# EAGLE design v2.2_lux (EAGLE 7.1.0)
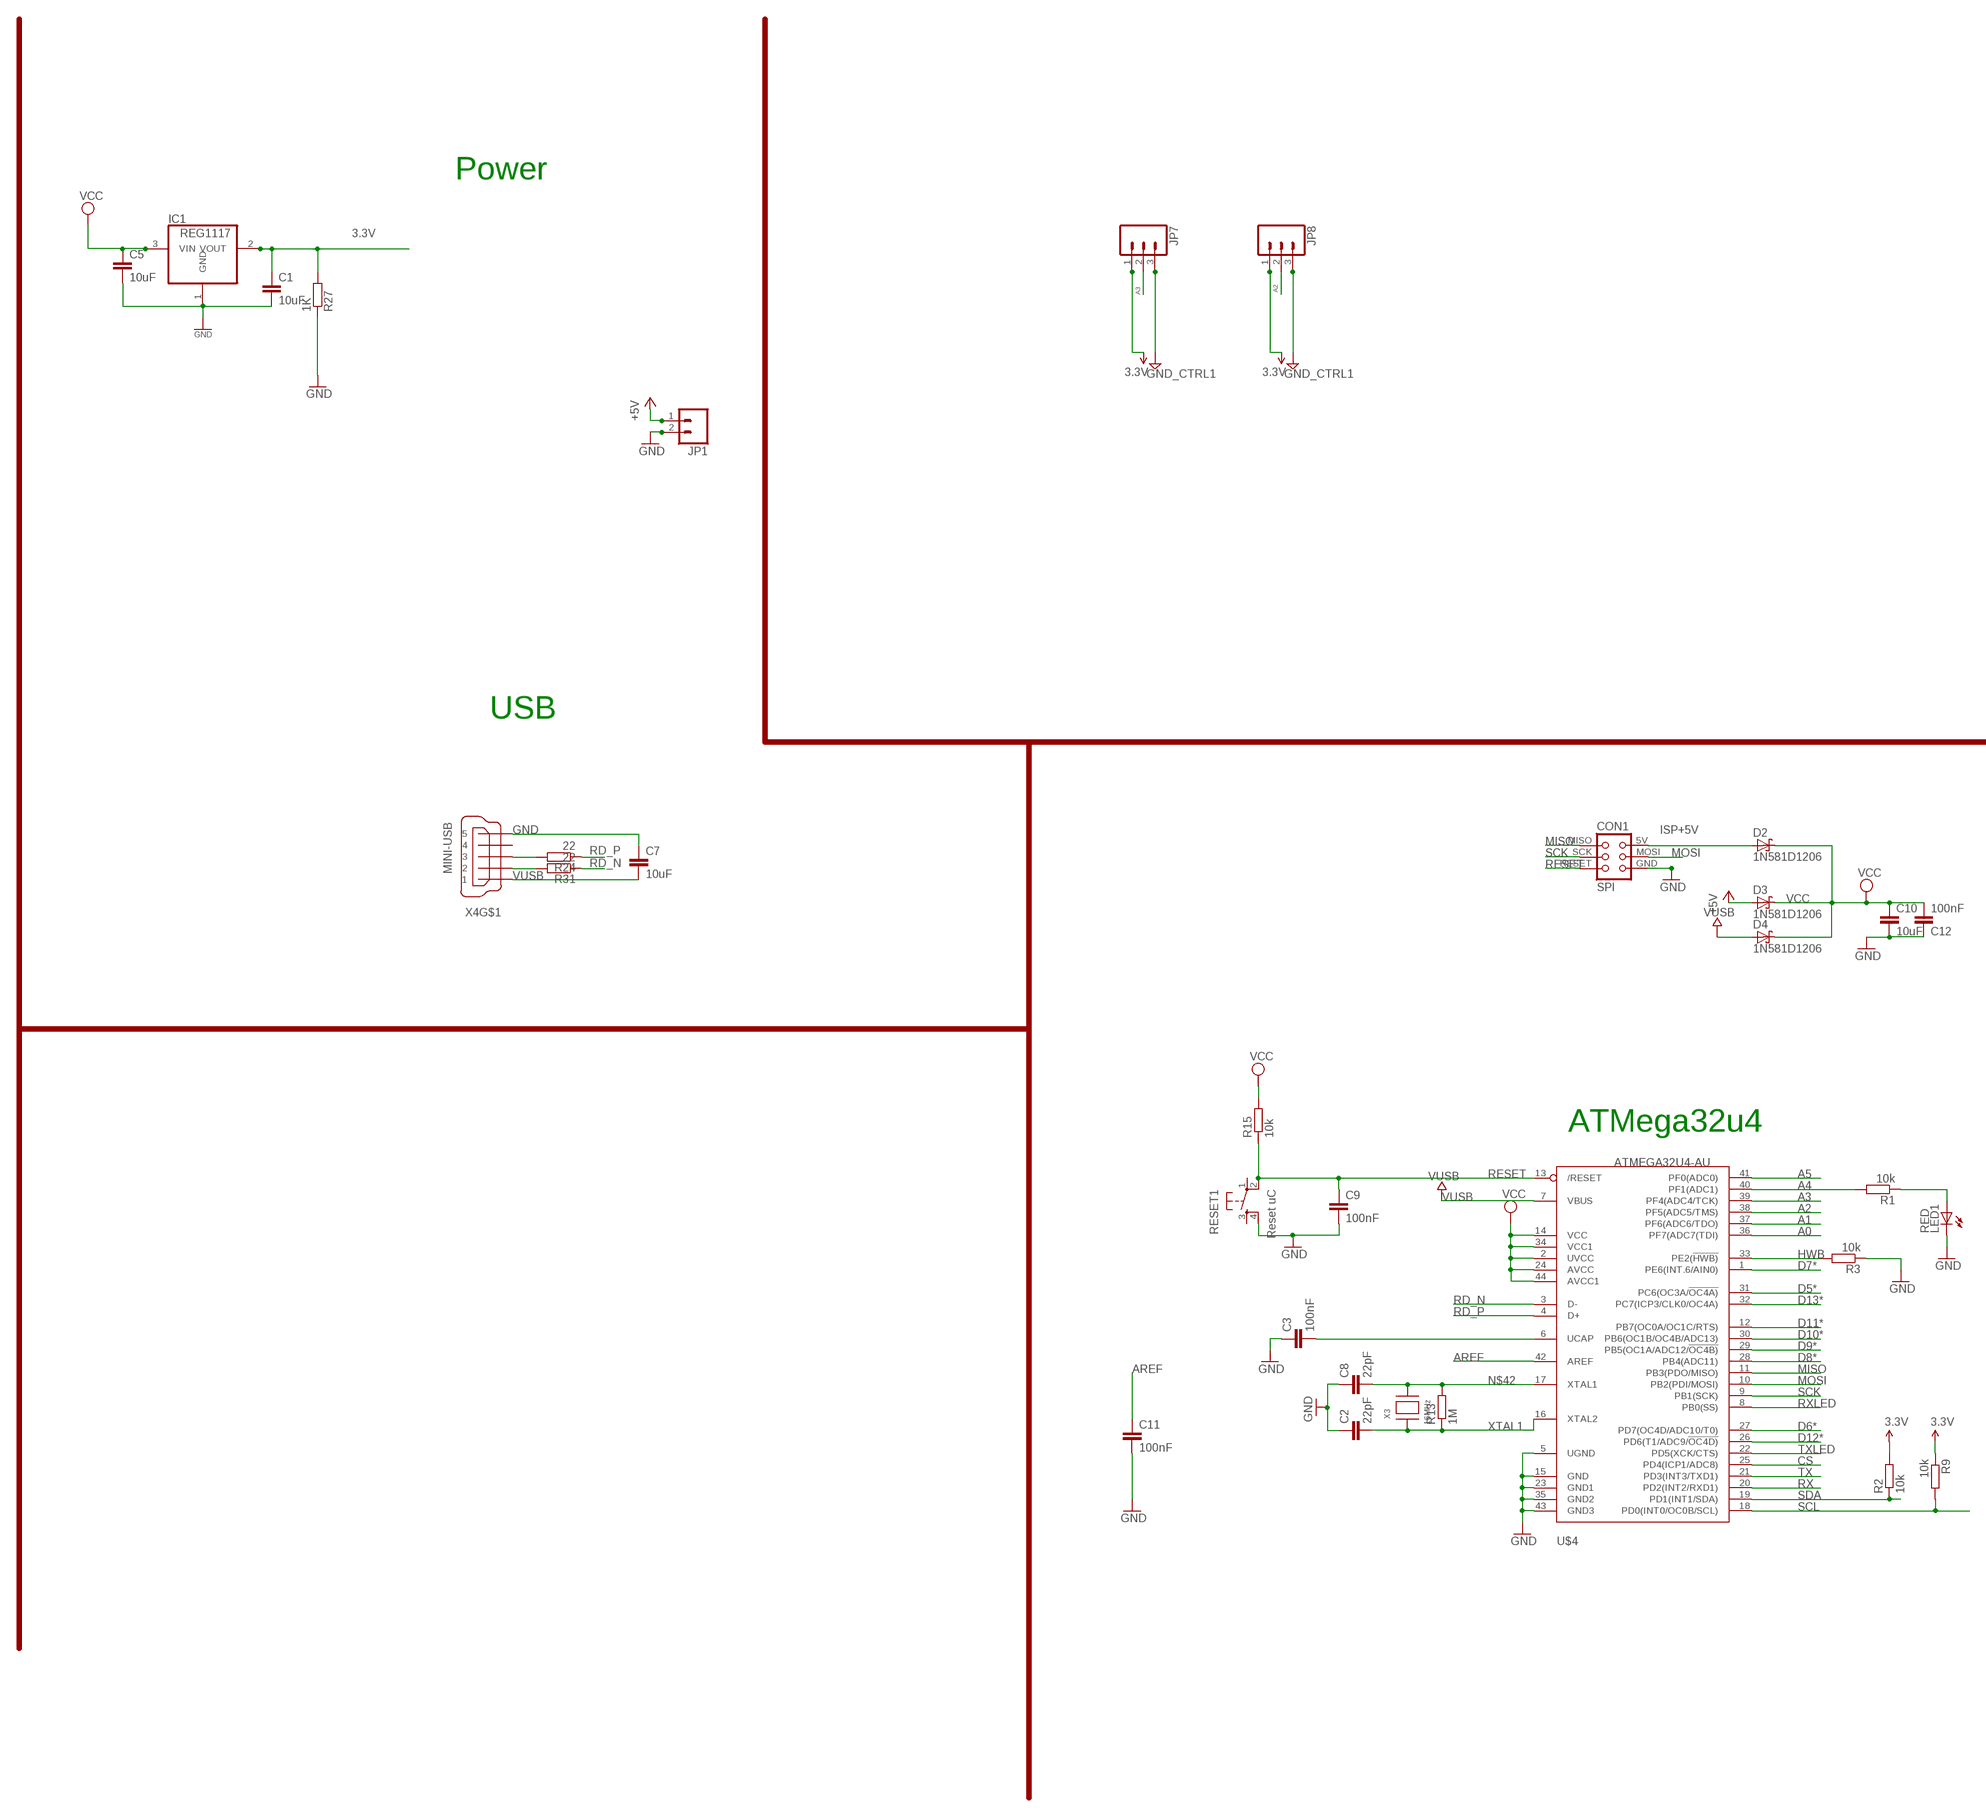
[diagram p0: schematic, sheet 1, part 1 of 2]
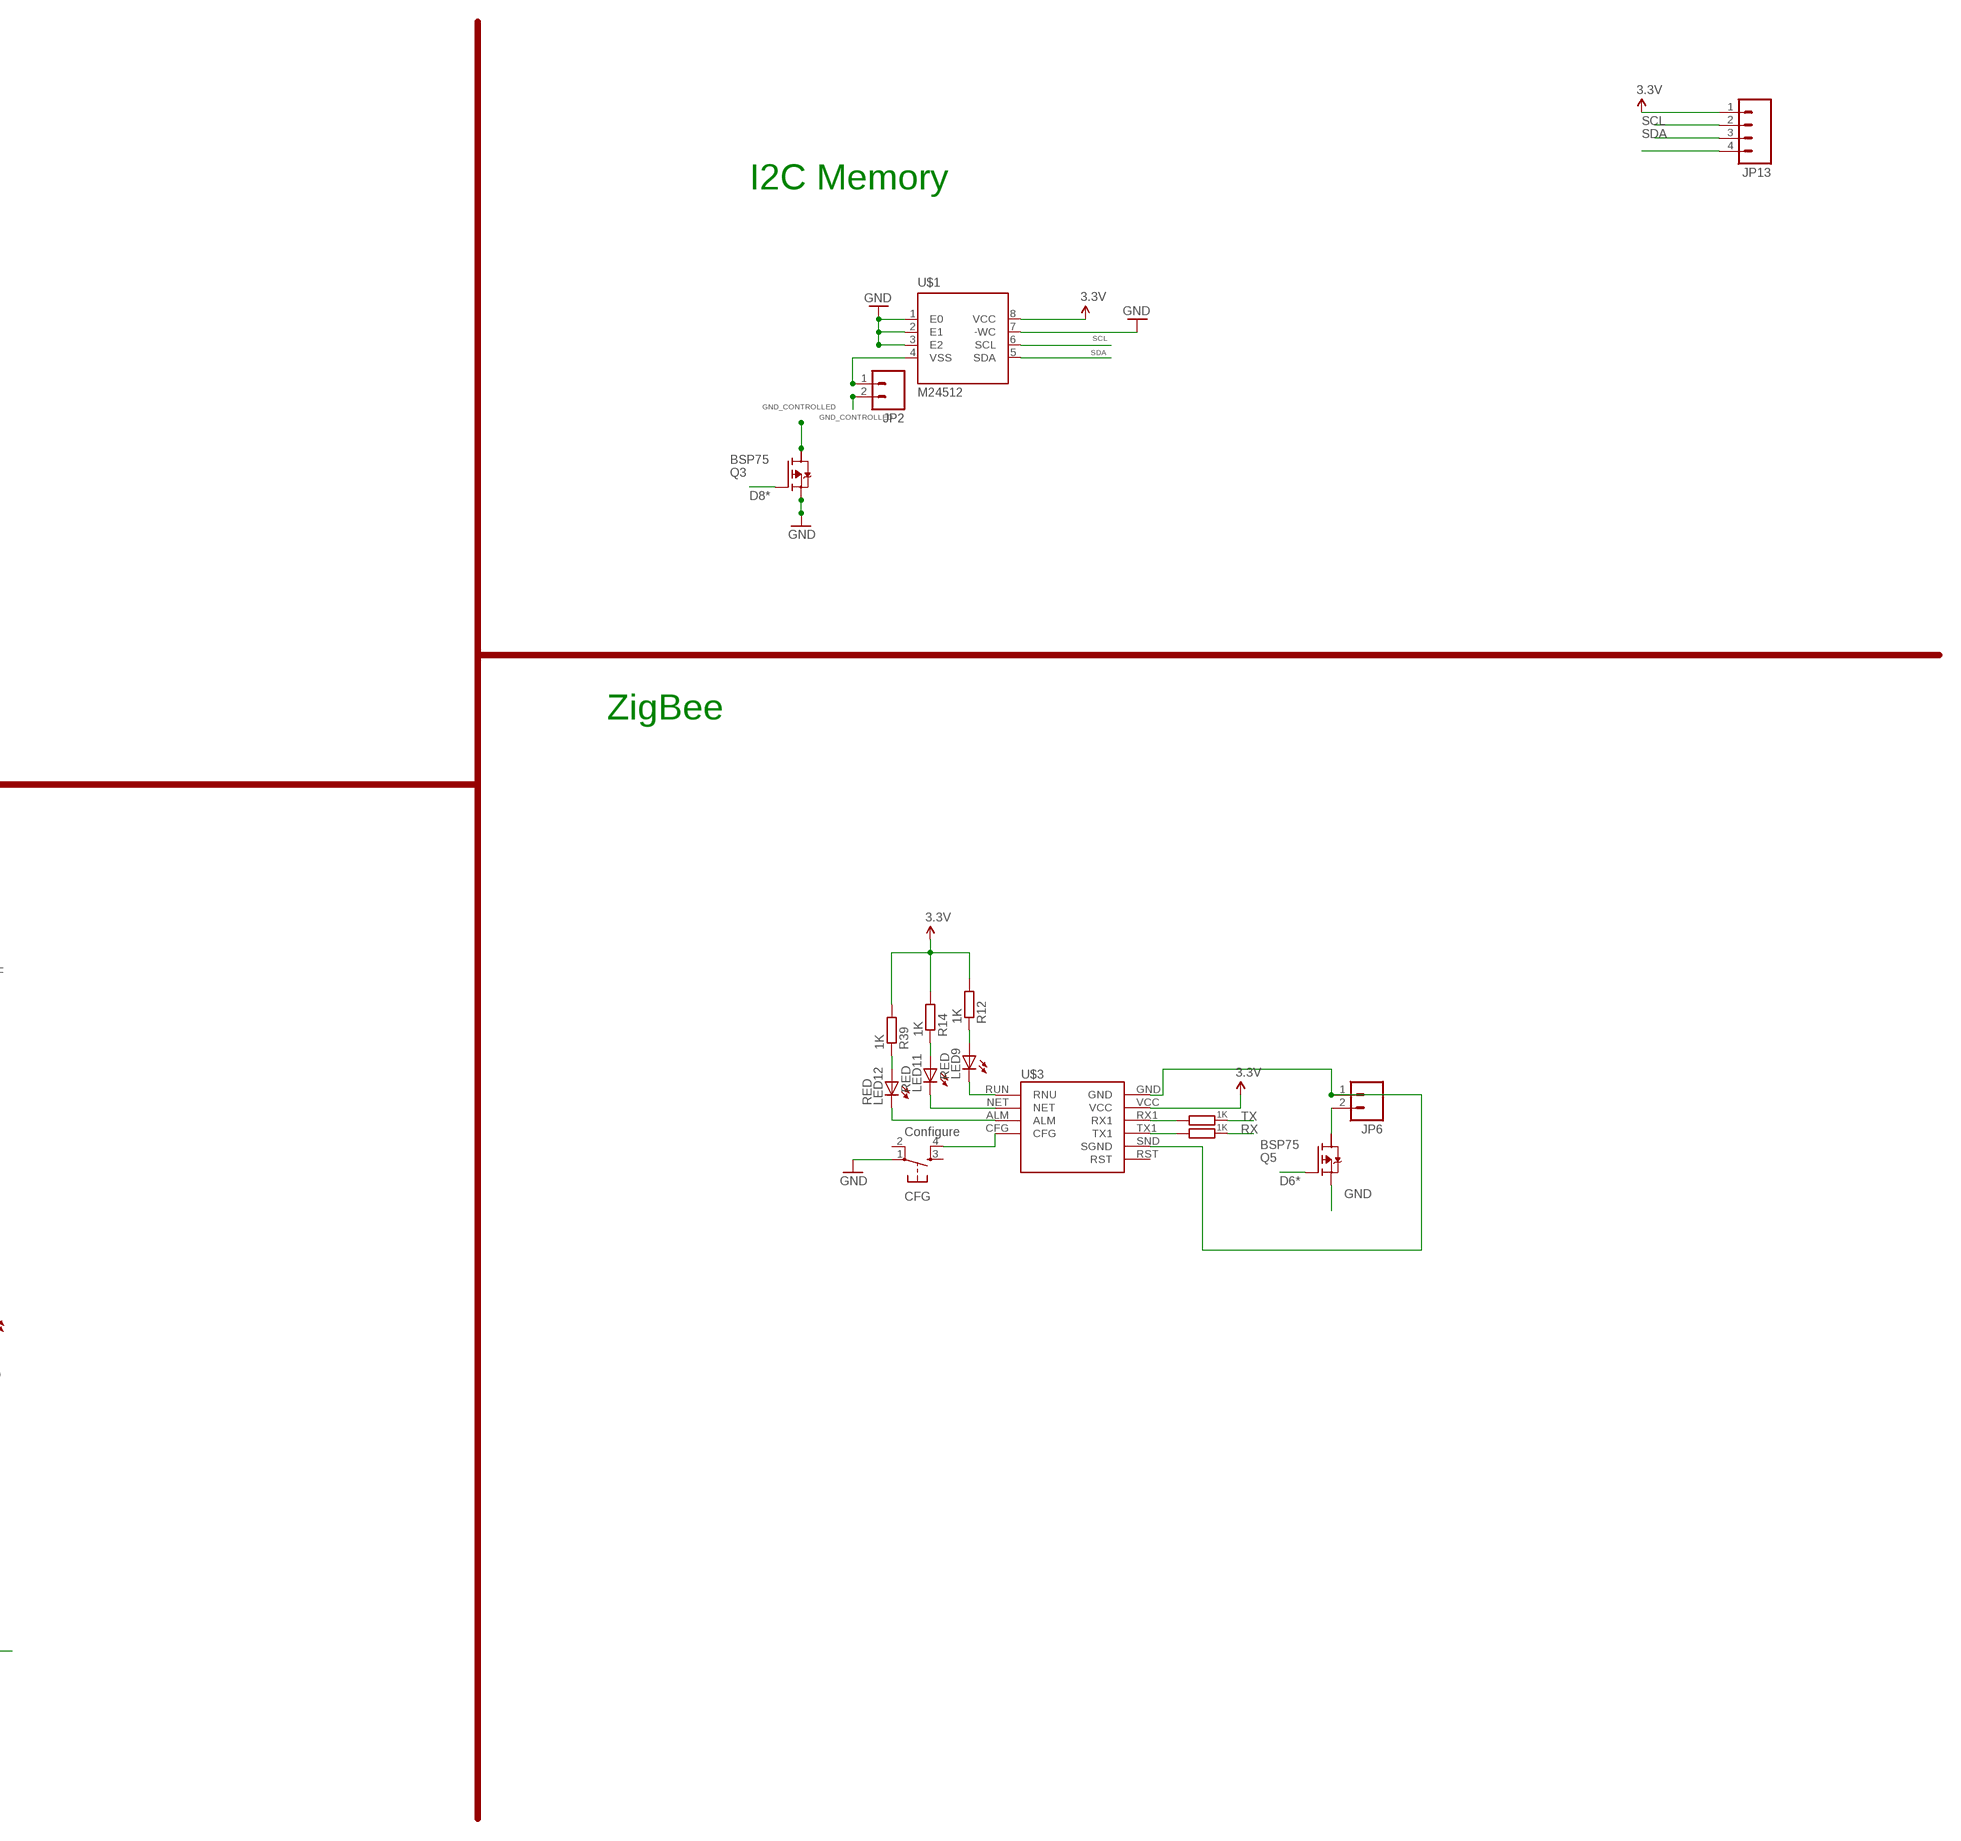
[diagram p1: schematic, sheet 1, part 2 of 2]

## Parts
C1  10uF  C-EUC1206  [C1206]
C2  22pF  C-EUC1206  [C1206]
C3  100nF  C-EUC1206  [C1206]
C5  10uF  C-EUC1206  [C1206]
C7  10uF  C-EUC1206  [C1206]
C8  22pF  C-EUC1206  [C1206]
C9  100nF  C-EUC1206  [C1206]
C10  10uF  C-EUC1206  [C1206]
C11  100nF  C-EUC1206  [C1206]
C12  100nF  C-EUC1206  [C1206]
CFG  Configure  TAC_SWITCHSMD  [TACTILE_SWITCH_SMD]
CON1  SPI  TINYISPT  [TC2030-MCP-NL]
D2  1N581D1206  [LED-1206]
D3  1N581D1206  [LED-1206]
D4  1N581D1206  [LED-1206]
IC1  REG1117  [SOT223]
JP1  M02LOCK_LONGPADS  [1X02_LOCK_LONGPADS]
JP2  M02LOCK_LONGPADS  [1X02_LOCK_LONGPADS]
JP6  M02LOCK_LONGPADS  [1X02_LOCK_LONGPADS]
JP7  M03LONGPADS  [1X03_LONGPADS]
JP8  M03LONGPADS  [1X03_LONGPADS]
JP13  M04LOCK_LONGPADS  [1X04_LOCK_LONGPADS]
LED1  RED  LEDCHIP-LED0805  [CHIP-LED0805]
LED9  RED  LEDCHIP-LED0805  [CHIP-LED0805]
LED11  RED  LEDCHIP-LED0805  [CHIP-LED0805]
LED12  RED  LEDCHIP-LED0805  [CHIP-LED0805]
Q3  BSP75  BSP613P  [PG-SOT-223]
Q5  BSP75  BSP613P  [PG-SOT-223]
R1  10k  R-EU_M1206  [M1206]
R2  10k  R-EU_M1206  [M1206]
R3  10k  R-EU_M1206  [M1206]
R8  1K  R-EU_R0805  [R0805]
R9  10k  R-EU_M1206  [M1206]
R11  1K  R-EU_R0805  [R0805]
R12  1K  R-EU_R0805  [R0805]
R13  1M  R-EU_R1206  [R1206]
R14  1K  R-EU_R0805  [R0805]
R15  10k  R-EU_M0805  [M0805]
R24  22  R-EU_M1206  [M1206]
R27  1K  R-EU_R0805  [R0805]
R31  22  R-EU_M1206  [M1206]
R39  1K  R-EU_R0805  [R0805]
RESET1  Reset uC  TAC_SWITCHSMD  [TACTILE_SWITCH_SMD]
U$1  M24512  [SO8]
U$3  SZ05-ZIGBEETHROUGHHOLE  [SZ05-ZIGBEE4]
U$4  ATMEGA32U4-AU  [TQFP44]
X3  16MHz  XTALNX6035  [NX6035]
X4  MINI-USB  MINI-USB-SCHIELD-32005-201  [32005-201]

## Nets
3.3V [power]: C1.1 IC1.2(VOUT) JP7.1 JP8.1 JP13.1 R2.2 R9.1 R12.2 R14.2 R27.2 R39.2 U$1.8(VCC) U$3.VCC
$12: JP2.1 U$1.4(VSS)
+5V [power]: D3.A JP1.1
A0: U$4.36(PF7(ADC7(TDI))
A1: U$4.37(PF6(ADC6/TDO))
A2: JP8.2 U$4.38(PF5(ADC5/TMS))
A3: JP7.2 U$4.39(PF4(ADC4/TCK))
A4: R1.2 U$4.40(PF1(ADC1))
A5: U$4.41(PF0(ADC0))
AREF: C11.1 U$4.42(AREF)
CS: U$4.25(PD4(ICP1/ADC8))
D5*: U$4.31(PC6(OC3A/!OC4A))
D6*: Q5.1(G) U$4.27(PD7(OC4D/ADC10/T0))
D7*: U$4.1(PE6(INT.6/AIN0))
D8*: Q3.1(G) U$4.28(PB4(ADC11))
D9*: U$4.29(PB5(OC1A/ADC12/!OC4B))
D10*: U$4.30(PB6(OC1B/OC4B/ADC13))
D11*: U$4.12(PB7(OC0A/OC1C/RTS))
D12*: U$4.26(PD6(T1/ADC9/!OC4D))
D13*: U$4.32(PC7(ICP3/CLK0/OC4A))
D+USB: R24.2 X4.3
D-USB: R31.2 X4.2
GND [power]: C1.2 C2.1 C3.1 C5.2 C7.1 C8.1 C9.2 C10.2 C11.2 C12.1 CFG.1 CON1.GND IC1.1(GND) JP1.2 JP7.3 JP8.3 LED1.C Q3.3(S) Q5.3(S) R3.1 R27.1 RESET1.4 U$1.1(E0) U$1.2(E1) U$1.3(E2) U$1.7(-WC) U$4.5(UGND) U$4.15(GND) U$4.23(GND1) U$4.35(GND2) U$4.43(GND3) X4.5 ; supply symbol labelled GND_CTRL1
GND1 [VIN]: LED9.C U$3.RUN(RNU)
GND2 [VIN]: LED11.C U$3.NET
GND3 [VIN]: LED12.C U$3.ALM
GND_CONTROLLED [power]: JP2.2 JP13.4 Q3.2(D)
HWB: R3.2 U$4.33(PE2(!HWB))
ISP+5V: CON1.5V(VCC) D2.A
MISO: CON1.MISO U$4.11(PB3(PDO/MISO))
MOSI: CON1.MOSI U$4.10(PB2(PDI/MOSI))
N$1: LED1.A R1.1
N$2: JP6.2 Q5.2(D)
N$4 [power]: JP6.1 U$3.GND U$3.SND(SGND)
N$11: R11.2 U$3.RX1
N$16: C3.2 U$4.6(UCAP)
N$24: R8.2 U$3.TX1
N$25: LED9.A R12.1
N$26: LED11.A R14.1
N$27: LED12.A R39.1
N$35: CFG.4 U$3.CFG
N$42: C8.2 R13.2 U$4.17(XTAL1) X3.P$2
RD_N: R31.1 U$4.3(D-)
RD_P: R24.1 U$4.4(D+)
RESET: C9.1 CON1.RESET R15.1 RESET1.2 U$4.13(/RESET)
RX: R8.1 U$4.20(PD2(INT2/RXD1))
RXLED: U$4.8(PB0(SS))
SCK: CON1.SCK U$4.9(PB1(SCK))
SCL: JP13.2 R9.2 U$1.6(SCL) U$4.18(PD0(INT0/OC0B/SCL))
SDA: JP13.3 R2.1 U$1.5(SDA) U$4.19(PD1(INT1/SDA))
TX: R11.1 U$4.21(PD3(INT3/TXD1))
TXLED: U$4.22(PD5(XCK/CTS))
VCC [fine]: C5.1 C10.1 C12.2 D2.C D3.C D4.C IC1.3(VIN) R15.2 U$4.2(UVCC) U$4.14(VCC) U$4.24(AVCC) U$4.34(VCC1) U$4.44(AVCC1)
VUSB: C7.2 D4.A U$4.7(VBUS) X4.1
XTAL1: C2.2 R13.1 U$4.16(XTAL2) X3.P$1
Unconnected: CFG.2 CFG.3 Q3.4(D) Q5.4(D) RESET1.1 RESET1.3 U$3.RST X4.4 X4.M1(S:S1) X4.M2(S:S2) X4.M3(S:S3) X4.M4(S:S4)

## Notes on the sheet
- Power
- I2C Memory
- ZigBee
- USB
- ATMega32u4

## Library data of the parts
C1-C3 C5 C7-C12 = rcl:C-EU: CAPACITOR, European symbol
CFG RESET1 = lpatiny:TAC_SWITCH: Momentary Switch Button commonly used for reset or general input. Spark Fun Electronics SKU : COM-00097
CON1 = lpatiny:TINYISP: CONNECTOR
D2-D4 = lpatiny:1N581*: 1.0A SCHOTTKY BARRIER RECTIFIER Source: http://www.diodes.com/datasheets/ds23001.pdf
IC1 = burr-brown:REG1117: 800mA and 1A Low Dropout (LDO) Positive Regulator 1.8V, 2.5V, 2.85V, 3.3V, 5V, and Adj; MPN: REG1117; OC_FARNELL: 1097566; OC_NEWARK: 14P6981
JP1 JP2 JP6 = SparkFun:M02: Header 2 Standard 2-pin 0.1" header. Use with straight break away headers (SKU : PRT-00116), right angle break away headers (PRT-00553), swiss pins (PRT-00743), machine pins (PRT-00117), and female headers (PRT-00115). Molex polarized connector foot print use with SKU : PRT-08233 with associated crimp pins and housings.
JP7 JP8 = SparkFun:M03: Header 3 Standard 3-pin 0.1" header. Use with straight break away headers (SKU : PRT-00116), right angle break away headers (PRT-00553), swiss pins (PRT-00743), machine pins (PRT-00117), and female headers (PRT-00115). Molex polarized connector foot print use with SKU : PRT-08232 with associated crimp pins and housings.
JP13 = SparkFun:M04: Header 4 Standard 4-pin 0.1" header. Use with straight break away headers (SKU : PRT-00116), right angle break away headers (PRT-00553), swiss pins (PRT-00743), machine pins (PRT-00117), and female headers (PRT-00115). Molex polarized connector foot print use with SKU : PRT-08231 with associated crimp pins and housings. 1MM SMD Version SKU: PRT-10208
LED1 LED9 LED11 LED12 = adafruit:LED: LED OSRAM: - CHIPLED LG R971, LG N971, LY N971, LG Q971, LY Q971, LO R971, LY R971 LH N974, LH R974 LS Q976, LO Q976, LY Q976 LO Q996 - Hyper CHIPLED LW Q18S LB Q993, LB Q99A, LB R99A - SideLED LS A670, LO A670, LY A670, LG A670, LP A670 LB A673, LV A673, LT A673, LW A673 LH A674 LY A675 LS A676, LA A676, LO A676, LY A676, LW A676 LS A679, LY A679, LG A679 - Hyper Micro SIDELED® LS Y876, LA Y876, LO Y876, LY Y876 LT Y87S - SmartLED LW L88C, LW L88S LB L89C, LB L89S, LG L890 LS L89K, LO L89K, LY L89K LS L896, LA L896, LO L896, LY L896 - TOPLED LS T670, LO T670, LY T670, LG T670, LP T670 LSG T670, LSP T670, LSY T670, LOP T670, LYG T670 LG T671, LOG T671, LSG T671 LB T673, LV T673, LT T673, LW T673 LH T674 LS T676, LA T676, LO T676, LY T676, LB T676, LH T676, LSB T676, LW T676 LB T67C, LV T67C, LT T67C, LS T67K, LO T67K, LY T67K, LW E67C LS E67B, LA E67B, LO E67B, LY E67B, LB E67C, LV E67C, LT E67C LW T67C LS T679, LY T679, LG T679 LS T770, LO T770, LY T770, LG T770, LP T770 LB T773, LV T773, LT T773, LW T773 LH T774 LS E675, LA E675, LY E675, LS T675 LS T776, LA T776, LO T776, LY T776, LB T776 LHGB T686 LT T68C, LB T68C - Hyper Mini TOPLED® LB M676 - Mini TOPLED Santana® LG M470 LS M47K, LO M47K, LY M47K Source: http://www.osram.convergy.de/
Q3 Q5 = infineon:BSP613P: SIPMOS (R) Small-Signal-Transistor P-Channel (2 Drain) Source: http://www.infineon.com/dgdl/BSP613P_Rev2.4.pdf; OC_FARNELL: unknown; OC_NEWARK: unknown
R1-R3 R9 R15 R24 R31 = resistor:R-EU_: RESISTOR, European symbol
R8 R11-R14 R27 R39 = rcl:R-EU_: RESISTOR, European symbol
U$1 = lpatiny:M24512
U$3 = lpatiny:SZ05-ZIGBEE
U$4 = adafruit:ATMEGA32U4: http://www.ladyada.net/library/eagle
X3 = lpatiny:XTAL: Low cost SMT crystals, no capacitors included http://www.ladyada.net/library/eagle
X4 = con-cypressindustries:MINI-USB-SCHIELD-: MINI USB-B Conector Source: www.cypressindustries.com; OC_FARNELL: unknown; OC_NEWARK: unknown

## Net classes
0 default: width 0.305 mm
1 power: width 0.61 mm
2 VIN: width 0.457 mm
3 fine: width 0.305 mm
4 aref: width 0.305 mm

## Board
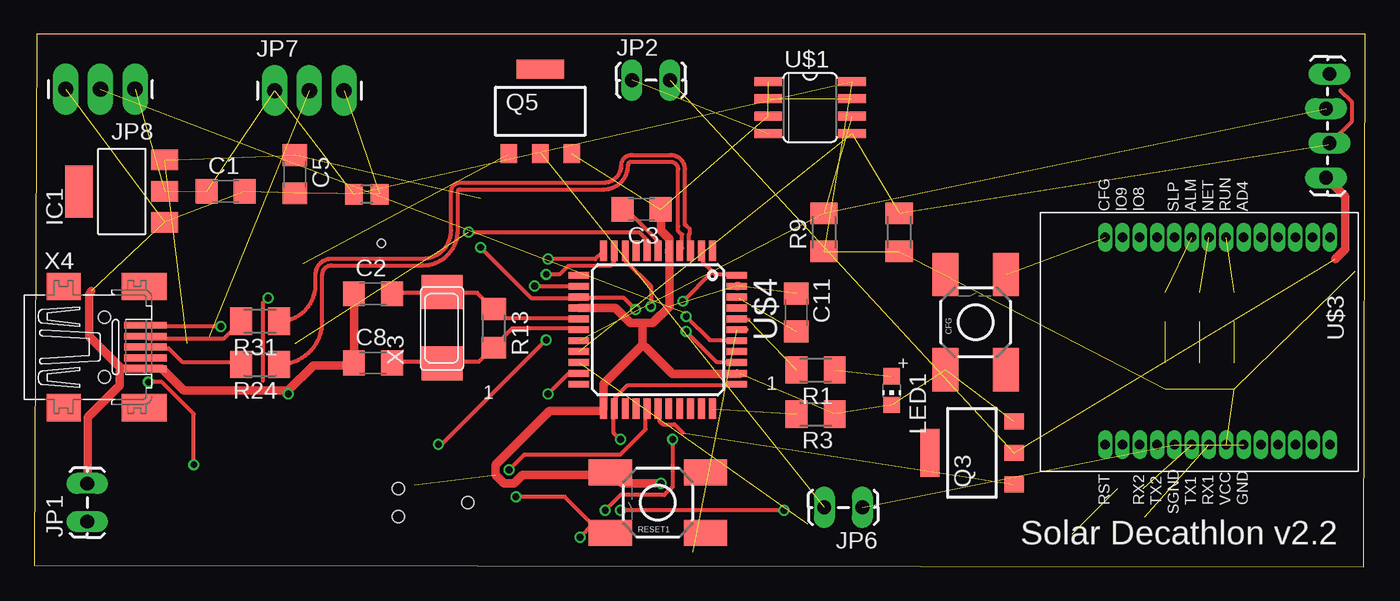
[diagram p2: board, top side]
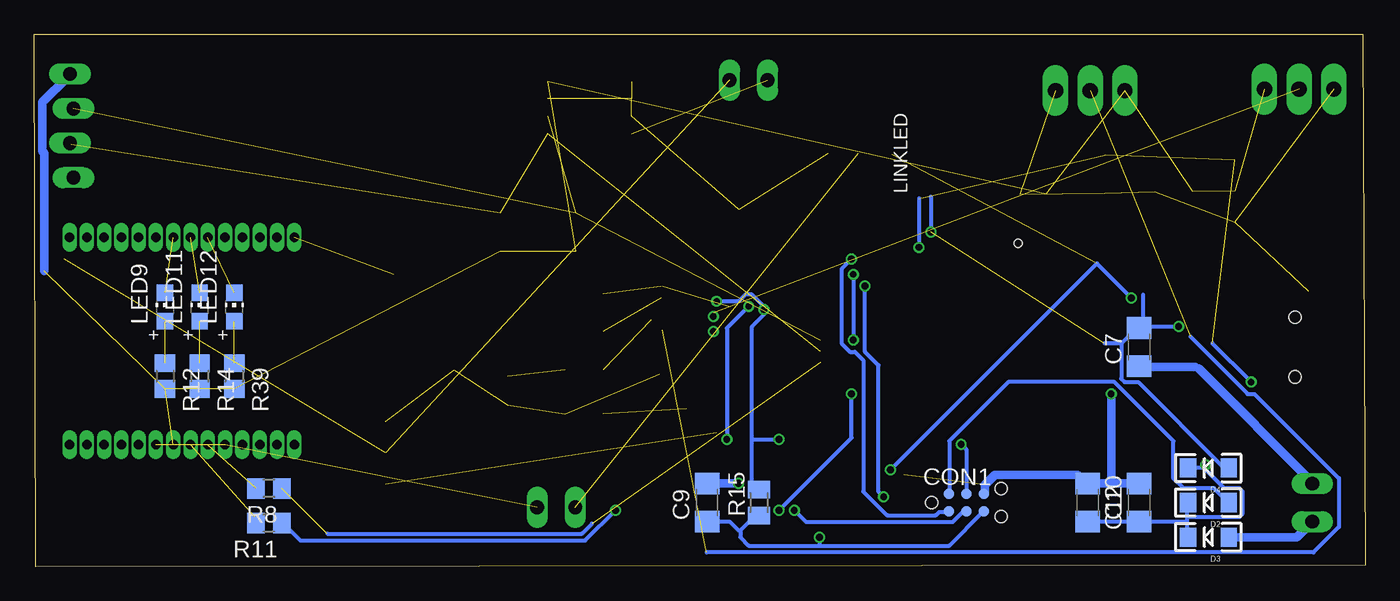
[diagram p3: board, bottom side, seen from below]

Size 97.76 x 39.16 mm. Coordinates in mm from the lower left corner, seen from the top.
Outline: 0,0.1 97.66,0 97.76,39.16 0.2,39.16 0,0.1
Copper layers (1*16): Top 0.035mm / dielectric 1.5mm / Bottom 0.035mm
Design rules "Fusion_eagle_rule_v1.1 *": minimum track width 6mil, minimum drill 0.5mm, track to track 7.5mil, track to pad 7.5mil, pad to pad 7.5mil, via to via 7.5mil, smd to smd 0mil, copper to edge 10mil, drill to drill 10mil, minimum pad ring 6mil, minimum via ring 6mil, stop-mask expansion 2mil, vias tented up to drill 100mil, thermal gap 10mil
Holes 0.6 mm at 25.5,23.77
bKeepout: area -1.2,56.8 to 114.4,84.7; area -7.5,54.3 to 108.1,82.2
vRestrict: area 38.2,20 to 53.4,25; area 38.2,9.8 to 53.4,14.9; area 48.4,9.8 to 53.4,25; area 38.2,9.8 to 43.3,25; area 25.5,0.9 to 34.4,8.5

### Footprints (pad centres in the part's own frame; a part is rotated, then mirrored left to right if it is on the bottom)
C1206 = smd 1.6 x 1.8: 1 -1.4,0; 2 1.4,0
TACTILE_SWITCH_SMD = smd 3.175 x 1.905: 1 -3.493,2.223; 2 3.493,2.223; 3 -3.493,-2.223; 4 3.493,-2.223
TC2030-MCP-NL = smd 0.787 x 0.787: 5V 1.27,0.635; GND 3.81,0.635; MISO 1.27,-0.635; MOSI 2.54,0.635; RESET 3.81,-0.635; SCK 2.54,-0.635 | hole 0.889: 0,0; 5.08,-1.016; 5.08,1.016
LED-1206 = smd 1.2 x 1.4: A -1.5,0; C 1.5,0
SOT223 = smd 1.499 x 2.007: 1 -2.261,-3.15; 2 0.025,-3.15; 3 2.311,-3.15 | smd 3.81 x 2.007: 4 0,3.15
1X02_LOCK_LONGPADS = drill 1.016 long: 1 -0.127,0; 2 2.667,0
1X03_LONGPADS = drill 1.118 pad 1.88 long: 1 0,0; 2 2.54,0; 3 5.08,0
1X04_LOCK_LONGPADS = drill 1.016 long: 1 0,0; 2 2.54,-0.254; 3 5.08,0; 4 7.62,-0.254
CHIP-LED0805 = smd 1.2 x 1.2: A 0,-1.05; C 0,1.05
PG-SOT-223 = smd 1.2 x 1.4: 1 -2.311,-3.099; 2 0,-3.099; 3 2.311,-3.099 | smd 3.5 x 1.4: 4 0,3.099
M1206 = smd 1.6 x 2: 1 -1.4,0; 2 1.4,0
R0805 = smd 1.3 x 1.5: 1 -0.95,0; 2 0.95,0
R1206 = smd 1.6 x 1.803: 1 -1.422,0; 2 1.422,0
M0805 = smd 1.3 x 1.6: 1 -0.95,0; 2 0.95,0
SO8 = smd 0.66 x 2.032: 1 -3.81,-3.073; 2 -2.54,-3.073; 3 -1.27,-3.073; 4 0,-3.073; 5 0,3.073; 6 -1.27,3.073; 7 -2.54,3.073; 8 -3.81,3.073
SZ05-ZIGBEE4 = drill 0.7 pad 1.016 long: AD1 -6.985,6.35; AD2 -6.985,5.08; AD3 -6.985,3.81; AD4 -6.985,2.54; ALM -6.985,-1.27; C485 -6.985,-3.81; CFG -6.985,-7.62; GND 8.255,2.54; IO1 -6.985,8.89; IO2 -6.985,7.62; IO3 8.255,8.89; IO4 8.255,7.62; IO5 8.255,6.35; IO6 8.255,5.08; IO7 8.255,3.81; IO8 -6.985,-5.08; IO9 -6.985,-6.35; MS 8.255,-6.35; NET -6.985,0; RST 8.255,-7.62; RUN -6.985,1.27; RX1 8.255,0; RX2 8.255,-5.08; SLD -6.985,-2.54; SND 8.255,-2.54; TX1 8.255,-1.27; TX2 8.255,-3.81; VCC 8.255,1.27
TQFP44 = smd 1.5 x 0.5: 1 -5.8,4; 2 -5.8,3.2; 3 -5.8,2.4; 4 -5.8,1.6; 5 -5.8,0.8; 6 -5.8,0; 7 -5.8,-0.8; 8 -5.8,-1.6; 9 -5.8,-2.4; 10 -5.8,-3.2; 11 -5.8,-4; 23 5.8,-4; 24 5.8,-3.2; 25 5.8,-2.4; 26 5.8,-1.6; 27 5.8,-0.8; 28 5.8,0; 29 5.8,0.8; 30 5.8,1.6; 31 5.8,2.4; 32 5.8,3.2; 33 5.8,4 | smd 0.5 x 1.5: 12 -4,-5.8; 13 -3.2,-5.8; 14 -2.4,-5.8; 15 -1.6,-5.8; 16 -0.8,-5.8; 17 0,-5.8; 18 0.8,-5.8; 19 1.6,-5.8; 20 2.4,-5.8; 21 3.2,-5.8; 22 4,-5.8; 34 4,5.8; 35 3.2,5.8; 36 2.4,5.8; 37 1.6,5.8; 38 0.8,5.8; 39 0,5.8; 40 -0.8,5.8; 41 -1.6,5.8; 42 -2.4,5.8; 43 -3.2,5.8; 44 -4,5.8
NX6035 = smd 2.5 x 3: P$1 2.665,0; P$2 -2.565,0
32005-201 = smd 3.1 x 0.5: 1 3,1.6; 2 3,0.8; 3 3,0; 4 3,-0.8; 5 3,-1.6 | smd 2.5 x 2: M1 -3,-4.45; M2 -3,4.45 | smd 3.3 x 2: M3 2.9,4.45; M4 2.9,-4.45 | hole 0.9: 0,2.2; 0,-2.2

### Placement (x,y rotation side)
C1  14.07,27.58 0 top
C2  24.89,20.07 0 top
C3  44.62,26.26 180 top
C5  19.15,28.85 270 top
C7  16.61,16.15 90 bottom
C8  24.89,14.99 0 top
C9  48.36,4.72 90 bottom
C10  16.61,4.72 90 bottom
C11  55.98,18.69 90 top
C12  20.42,4.72 270 bottom
CFG  69.16,17.98 90 top
CON1  31.85,4.72 0 bottom
D2  11.53,4.72 180 bottom
D3  11.53,2.18 180 bottom
D4  11.53,7.26 180 bottom
IC1  6.45,27.58 90 top
JP1  3.91,3.45 90 top
JP2  44.04,35.76 0 top
JP6  60.71,4.37 180 top
JP7  17.68,35 0 top
JP8  7.42,35.1 180 top
JP13  95.15,36.22 270 top
LED1  62.99,12.95 180 top
LED9  88.16,19.1 0 bottom
LED11  85.62,19.1 0 bottom
LED12  83.08,19.1 0 bottom
Q3  68.88,8.38 90 top
Q5  37.19,33.48 0 top
R1  57.4,14.48 180 top
R2  63.55,24.59 270 top
R3  57.4,11.23 180 top
R8  80.54,5.77 180 bottom
R9  58.01,24.59 90 top
R11  80.54,3.23 180 bottom
R12  88.16,14.02 270 bottom
R13  33.78,17.53 270 top
R14  85.62,14.02 270 bottom
R15  44.55,4.72 90 bottom
R24  16.61,14.88 180 top
R27  24.43,27.38 180 top
R31  16.61,18.06 180 top
R39  83.08,14.02 270 bottom
RESET1  45.82,4.72 180 top
U$1  57,31.85 270 top
U$3  86.3,17.23 270 top
U$4  45.82,17.42 270 top
X3  29.97,17.53 90 top
X4  5.18,16.15 0 top

### Tracks (layer width: path | path; a pad name or v marks a point on that pad's centre or on a via)
3.3V  (12 unrouted)
  Top 0.61: 95.08,36.11 JP13.1
  Bottom 0.61: 95.08,36.11 JP13.1 95.32,35.99 97.18,34.13 97.18,30.54 97.06,30.42 97.06,21.75
$12  (1 unrouted)
+5V
  Bottom 0.61: D3.A 5.05,2.18 JP1.1
A0  (via drill 0.5)
  Top 0.305: v47.9,17.29 50.13,15.06 51.61,15.06 U$4.36
A2  (via drill 0.5)  (1 unrouted)
  Top 0.305: v47.9,18.41 49.63,16.67 51.61,16.67 U$4.38
  Bottom 0.305: 47.9,18.65 v47.9,18.41
A3  (2 unrouted)
  Top 0.305: 52.36,17.41 51.74,17.41 U$4.39
  Bottom 0.305: 48.39,1.07 3.82,1.07 1.96,2.93 1.96,6.52 8.15,12.71 8.65,12.71 12.86,16.92
A4  (1 unrouted)
  Top 0.305: 52.48,18.16 51.74,18.16 U$4.40
AREF  (1 unrouted)
  Top 0.305: 51.74,19.77 U$4.42
D6*  (via drill 0.5)  (1 unrouted)
  Top 0.305: 16.82,13.7 16.82,19.4 v17.19,19.77 | 34.77,30.29 Q5.1 | v34.9,7.14 36.01,8.25 43.07,8.25 44.93,10.11 44.93,11.6 U$4.27
  Bottom 0.305: v17.19,19.77 19.73,22.31 v34.9,7.14
D8*  (1 unrouted)
  Top 0.305: 47.65,9.86 47.03,10.48 46.16,10.48 45.92,10.73 45.92,11.6 U$4.28
D+USB
  Top 0.305: 15.14,14.99 R24.2 15.08,15.06 10.87,15.06 9.88,16.05 8.27,16.05 X4.3
D-USB
  Top 0.305: 15.14,18.03 R31.2 15.08,17.91 13.97,16.8 8.4,16.8 8.27,16.92 X4.2
GND  (via drill 0.5)  (18 unrouted)
  Top 0.61: C3.1 46.04,26.21 46.04,24.72 46.66,24.1 46.66,23.48 U$4.5 46.66,23.11 46.66,19.15 45.42,17.91 44.68,17.91 | 6.42,14.57 4.06,16.92 4.06,20.02 4.19,20.26 | 6.42,14.57 8.15,14.57 X4.5 8.4,14.57 9.39,14.57 11,12.96 18.68,12.96 | 6.42,14.57 6.29,14.32 6.29,13.33 3.94,10.98 3.94,6.15 JP1.2 | v46.04,6.15 43.19,6.15 42.45,6.89 RESET1.4 42.08,6.77 35.89,6.77 35.27,6.15 34.52,6.15 33.91,6.77 33.91,7.51 37.87,11.47 41.58,11.47 U$4.23 41.83,11.72 41.83,13.45 44.68,16.3 | 44.68,17.91 43.81,17.91 42.7,19.02 40.1,19.02 U$4.15 | 44.68,17.91 44.68,16.3 | 44.68,16.3 44.93,16.18 46.91,14.2 51.61,14.2 U$4.35 51.86,14.2 | 51.74,20.63 U$4.43 | C2.1 23.5,20.02 23.5,15.06 C8.1 23.26,14.81 20.53,14.81 18.68,12.96 | v18.68,12.71 18.68,12.96
  Bottom 0.61: C7.1 16.57,14.69 12.48,14.69 12.24,14.57 3.82,6.15 JP1.2 | v46.04,6.15 48.27,6.15 C9.2 | CON1.GND 27.96,5.4 27.96,6.02 27.22,6.77 21.15,6.77 20.53,6.15 C12.1 20.16,6.15 18.68,6.15 | 18.68,6.15 16.69,6.15 C10.2 | v18.68,12.71 18.68,6.15
GND1  (1 unrouted)
GND2  (1 unrouted)
GND3  (1 unrouted)
GND_CONTROLLED  (2 unrouted)
  Top 0.61: 95.57,22.62 96.31,23.36 96.31,27.2 94.95,28.56 JP13.4
  Bottom 0.61: 94.83,28.56 JP13.4
HWB  (1 unrouted)
  Top 0.305: 49.88,11.6 U$4.33
ISP+5V
  Bottom 0.305: CON1.5V 30.56,5.4 30.56,9.24 26.23,13.58 18.43,13.58 14.09,9.24 14.09,6.52 13.35,5.78 11.12,5.78 10.13,4.78 D2.A
MISO  (via drill 0.5)
  Top 0.305: v37.74,22.62 41.21,22.62 41.71,23.11 U$4.11
  Bottom 0.305: v37.74,22.62 38.49,21.87 38.49,16.42 37.87,15.81 37.5,15.81 36.88,15.19 36.88,5.53 35.14,3.79 31.55,3.79 31.31,4.04 30.69,4.04 CON1.MISO
MOSI  (via drill 0.5)
  Top 0.305: v29.7,8.99 29.94,8.99 v37.62,16.67 | v37.62,21.5 38.61,21.5 39.23,22.12 42.33,22.12 42.57,22.37 42.57,23.11 U$4.10
  Bottom 0.305: v29.7,8.99 29.32,8.62 29.32,5.4 CON1.MOSI | v37.62,21.5 v37.62,16.67
N$1  (1 unrouted)
N$2  (1 unrouted)
  Top 0.305: 37.25,30.42 Q5.2
N$4  (2 unrouted)
N$11  (1 unrouted)
  Bottom 0.305: 81.58,3.67 81.58,3.3 R11.2
N$16
  Top 0.305: C3.2 43.32,26.21 43.56,26.21 45.79,23.98 45.79,23.23 U$4.6
N$24  (1 unrouted)
N$25  (1 unrouted)
N$26  (1 unrouted)
N$27  (1 unrouted)
N$35  (1 unrouted)
N$42
  Top 0.305: C8.2 26.35,15.06 29.94,15.06 X3.P$2 30.07,15.06 32.67,15.06 33.66,16.05 R13.2 33.78,16.18 35.14,17.54 39.97,17.54 U$4.17
RD_N
  Top 0.305: R31.1 arc90 20.68,20.73 20.68,21.49 arc-90 21.84,22.65 28.55,22.65 arc90 30.64,24.74 30.64,27.58 arc-90 31.29,28.24 41.86,28.24 arc90 43.14,29.51 arc-90 43.89,30.27 46.74,30.27 arc-90 47.8,29.21 47.8,25.15 47.9,25.09 48.15,24.84 48.15,24.47 48.1,24.43 48.1,23.34 arc90 U$4.3
RD_P
  Top 0.305: R24.1 arc90 21.18,18.05 21.18,21.49 arc-90 21.84,22.16 28.55,22.16 arc90 31.13,24.74 31.13,27.58 arc-90 31.29,27.74 41.86,27.74 arc90 43.63,29.51 arc-90 43.89,29.78 46.74,29.78 arc-90 47.3,29.21 47.3,25.04 47.28,24.97 47.28,24.72 47.53,24.47 47.61,24.43 47.61,23.41 47.53,23.36 47.53,23.23 U$4.4
RESET  (via drill 0.5)
  Top 0.305: v36.75,20.63 39.97,20.63 U$4.13 | v35.39,5.16 38.98,5.16 41.58,2.56 42.33,2.56 RESET1.2 40.96,3.05 v40.1,2.18
  Bottom 0.305: 40.1,1.57 45.3,1.57 45.92,2.18 45.92,2.68 | 40.1,1.57 30.56,1.57 28.09,4.04 CON1.RESET | 45.92,2.68 44.93,3.67 44.55,3.67 R15.1 | C9.1 48.27,3.3 46.66,3.3 46.04,2.68 45.92,2.68 | v36.75,20.63 36.75,15.81 35.76,14.81 35.76,5.53 v35.39,5.16 | v40.1,2.18 40.1,1.57
RX  (2 unrouted)
  Bottom 0.305: 56.81,3.18 57.56,2.43 76.25,2.43
SCK  (via drill 0.5)
  Top 0.305: v41.95,4.17 43.07,5.28 46.29,5.28 46.91,5.9 v46.91,9.37 | v45.3,19.15 45.3,20.63 43.44,22.49 43.44,23.11 U$4.9
  Bottom 0.305: v41.95,4.17 41.09,3.3 30.31,3.3 29.57,4.04 29.32,4.04 CON1.SCK | v46.91,9.37 46.91,17.54 v45.3,19.15
SCL  (3 unrouted)
SDA  (3 unrouted)
  Top 0.305: 95.94,35 96.81,34.13 96.81,32.77 95.2,31.16 JP13.3 95.08,31.04
TX  (via drill 0.5)
  Top 0.305: v37.74,12.71 39.23,14.2 39.97,14.2 U$4.21 | v55.08,4.17 v43.07,4.17
  Bottom 0.305: v37.74,12.71 37.74,9.49 v43.07,4.17 | v55.08,4.17 57.31,1.94 78.24,1.94 79.47,3.18 R11.1
VCC  (via drill 0.5)  (3 unrouted)
  Top 0.305: U$4.34 51.61,13.33 43.56,13.33 42.7,12.46 42.7,11.72 U$4.24 42.57,11.47 42.57,9.86 v43.07,9.37 | 49.82,21.69 50,21.5 51.61,21.5 U$4.44 | 49.82,21.69 49.14,22.37 49.14,23.11 U$4.2 | v44.18,18.9 43.32,19.77 40.1,19.77 U$4.14 39.97,19.77 36.51,19.77 v32.79,23.48 | v47.65,19.52 49.82,21.69 | v8.4,13.58 9.39,13.58 11.74,11.22 v11.74,7.51
  Bottom 0.305: 45.05,9.37 45.05,6.27 44.55,5.78 R15.2 | 45.05,9.37 45.05,17.66 44.18,18.53 v44.18,18.9 44.18,19.15 45.05,20.02 45.55,20.02 46.04,19.52 v47.65,19.52 | 45.05,9.37 v43.07,9.37 | 13.1,3.67 13.1,4.66 D2.C | 13.1,3.67 13.1,3.3 | 13.1,3.3 13.1,2.18 D3.C | 11.86,7.26 12.98,7.26 D4.C | 11.86,7.26 10.38,5.78 9.26,5.78 9.02,5.53 9.02,3.92 9.26,3.67 13.1,3.67 | 13.1,3.3 16.57,3.3 C10.1 16.69,3.3 20.41,3.3 C12.2 | v8.4,13.58 11.25,16.42 | v11.74,7.51 11.86,7.39 11.86,7.26 | 32.79,27.07 v32.79,23.48
VUSB  (via drill 0.5)  (1 unrouted)
  Top 0.305: v31.92,24.6 44.43,24.6 45.05,23.98 45.05,23.23 U$4.7 | v13.72,17.66 8.27,17.66 X4.1
  Bottom 0.305: 16.76,17.63 C7.2 | 16.56,17.63 C7.2 | 17.93,16.42 17.93,13.82 17.68,13.58 16.69,13.58 10.5,7.39 10.13,7.39 D4.A | 17.93,16.42 16.82,17.54 C7.2 | 17.93,16.42 19.17,16.42 | v13.72,17.66 16.45,17.66 C7.2 | 31.92,27.2 v31.92,24.6 | 16.32,20.02 16.32,17.79 C7.2
XTAL1
  Top 0.305: C2.2 26.35,20.14 29.94,20.14 X3.P$1 30.07,20.14 32.54,20.14 33.66,19.02 R13.1 33.78,18.9 34.4,18.28 39.97,18.28 U$4.16

### Text on the board
tNames: 1 | 1 | Solar Decathlon v2.2
bNames: USB | TX/RX | LINKLED
tValues: GND_CTRL SDA SCL 3.3V
203bmp: C:/Users/G/Pictures/logo_epfl.bmp